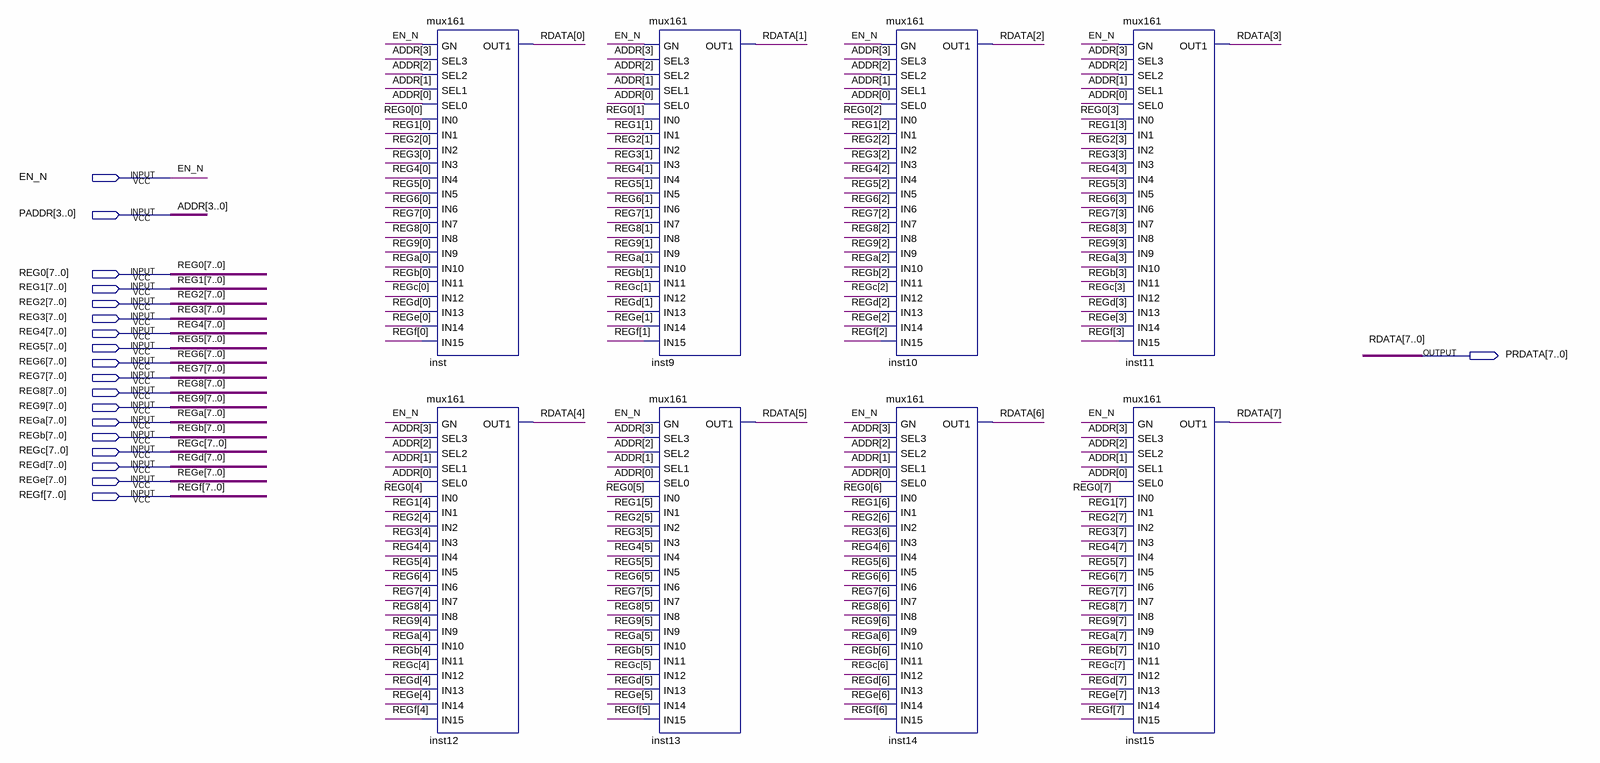
[diagram p0: schematic sheet]
// Quartus schematic MUX8_161.bdf as structural Verilog: 8 symbols, 19 pins
module MUX8_161 (
  input  EN_N,
  input  [3:0] PADDR,
  input  [7:0] REG0,
  input  [7:0] REG1,
  input  [7:0] REG2,
  input  [7:0] REG3,
  input  [7:0] REG4,
  input  [7:0] REG5,
  input  [7:0] REG6,
  input  [7:0] REG7,
  input  [7:0] REG8,
  input  [7:0] REG9,
  input  [7:0] REGa,
  input  [7:0] REGb,
  input  [7:0] REGc,
  input  [7:0] REGd,
  input  [7:0] REGe,
  input  [7:0] REGf,
  output [7:0] PRDATA
);

  mux161 inst (
    .GN(EN_N), .SEL3(PADDR[3]), .SEL2(PADDR[2]), .SEL1(PADDR[1]), .SEL0(PADDR[0]), .IN0(REG0[0]),
    .IN1(REG1[0]), .IN2(REG2[0]), .IN3(REG3[0]), .IN4(REG4[0]), .IN5(REG5[0]), .IN6(REG6[0]), .IN7(REG7[0]),
    .IN8(REG8[0]), .IN9(REG9[0]), .IN10(REGa[0]), .IN11(REGb[0]), .IN12(REGc[0]), .IN13(REGd[0]),
    .IN14(REGe[0]), .IN15(REGf[0]), .OUT1(PRDATA[0]));
  mux161 inst12 (
    .GN(EN_N), .SEL3(PADDR[3]), .SEL2(PADDR[2]), .SEL1(PADDR[1]), .SEL0(PADDR[0]), .IN0(REG0[4]),
    .IN1(REG1[4]), .IN2(REG2[4]), .IN3(REG3[4]), .IN4(REG4[4]), .IN5(REG5[4]), .IN6(REG6[4]), .IN7(REG7[4]),
    .IN8(REG8[4]), .IN9(REG9[4]), .IN10(REGa[4]), .IN11(REGb[4]), .IN12(REGc[4]), .IN13(REGd[4]),
    .IN14(REGe[4]), .IN15(REGf[4]), .OUT1(PRDATA[4]));
  mux161 inst9 (
    .GN(EN_N), .SEL3(PADDR[3]), .SEL2(PADDR[2]), .SEL1(PADDR[1]), .SEL0(PADDR[0]), .IN0(REG0[1]),
    .IN1(REG1[1]), .IN2(REG2[1]), .IN3(REG3[1]), .IN4(REG4[1]), .IN5(REG5[1]), .IN6(REG6[1]), .IN7(REG7[1]),
    .IN8(REG8[1]), .IN9(REG9[1]), .IN10(REGa[1]), .IN11(REGb[1]), .IN12(REGc[1]), .IN13(REGd[1]),
    .IN14(REGe[1]), .IN15(REGf[1]), .OUT1(PRDATA[1]));
  mux161 inst13 (
    .GN(EN_N), .SEL3(PADDR[3]), .SEL2(PADDR[2]), .SEL1(PADDR[1]), .SEL0(PADDR[0]), .IN0(REG0[5]),
    .IN1(REG1[5]), .IN2(REG2[5]), .IN3(REG3[5]), .IN4(REG4[5]), .IN5(REG5[5]), .IN6(REG6[5]), .IN7(REG7[5]),
    .IN8(REG8[5]), .IN9(REG9[5]), .IN10(REGa[5]), .IN11(REGb[5]), .IN12(REGc[5]), .IN13(REGd[5]),
    .IN14(REGe[5]), .IN15(REGf[5]), .OUT1(PRDATA[5]));
  mux161 inst10 (
    .GN(EN_N), .SEL3(PADDR[3]), .SEL2(PADDR[2]), .SEL1(PADDR[1]), .SEL0(PADDR[0]), .IN0(REG0[2]),
    .IN1(REG1[2]), .IN2(REG2[2]), .IN3(REG3[2]), .IN4(REG4[2]), .IN5(REG5[2]), .IN6(REG6[2]), .IN7(REG7[2]),
    .IN8(REG8[2]), .IN9(REG9[2]), .IN10(REGa[2]), .IN11(REGb[2]), .IN12(REGc[2]), .IN13(REGd[2]),
    .IN14(REGe[2]), .IN15(REGf[2]), .OUT1(PRDATA[2]));
  mux161 inst14 (
    .GN(EN_N), .SEL3(PADDR[3]), .SEL2(PADDR[2]), .SEL1(PADDR[1]), .SEL0(PADDR[0]), .IN0(REG0[6]),
    .IN1(REG1[6]), .IN2(REG2[6]), .IN3(REG3[6]), .IN4(REG4[6]), .IN5(REG5[6]), .IN6(REG6[6]), .IN7(REG7[6]),
    .IN8(REG8[6]), .IN9(REG9[6]), .IN10(REGa[6]), .IN11(REGb[6]), .IN12(REGc[6]), .IN13(REGd[6]),
    .IN14(REGe[6]), .IN15(REGf[6]), .OUT1(PRDATA[6]));
  mux161 inst11 (
    .GN(EN_N), .SEL3(PADDR[3]), .SEL2(PADDR[2]), .SEL1(PADDR[1]), .SEL0(PADDR[0]), .IN0(REG0[3]),
    .IN1(REG1[3]), .IN2(REG2[3]), .IN3(REG3[3]), .IN4(REG4[3]), .IN5(REG5[3]), .IN6(REG6[3]), .IN7(REG7[3]),
    .IN8(REG8[3]), .IN9(REG9[3]), .IN10(REGa[3]), .IN11(REGb[3]), .IN12(REGc[3]), .IN13(REGd[3]),
    .IN14(REGe[3]), .IN15(REGf[3]), .OUT1(PRDATA[3]));
  mux161 inst15 (
    .GN(EN_N), .SEL3(PADDR[3]), .SEL2(PADDR[2]), .SEL1(PADDR[1]), .SEL0(PADDR[0]), .IN0(REG0[7]),
    .IN1(REG1[7]), .IN2(REG2[7]), .IN3(REG3[7]), .IN4(REG4[7]), .IN5(REG5[7]), .IN6(REG6[7]), .IN7(REG7[7]),
    .IN8(REG8[7]), .IN9(REG9[7]), .IN10(REGa[7]), .IN11(REGb[7]), .IN12(REGc[7]), .IN13(REGd[7]),
    .IN14(REGe[7]), .IN15(REGf[7]), .OUT1(PRDATA[7]));

  // Other names for the same wires on the sheet: ADDR[3:0] = PADDR; RDATA[7:0] = PRDATA
endmodule
